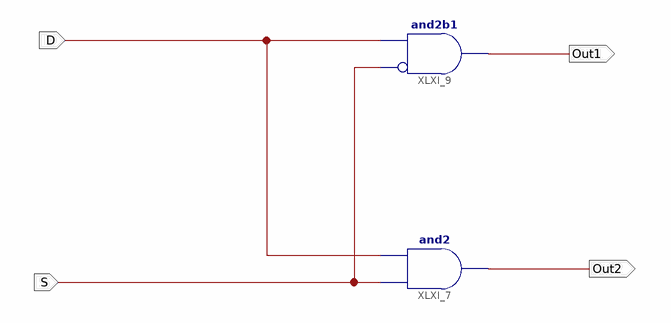
[diagram p0: schematic sheet 1]
// Xilinx ISE schematic demux2_1.sch (spartan3e) as structural Verilog: 2 symbols, 4 ports
module demux2_1 (
  input  S,
  input  D,
  output Out1,
  output Out2
);

  and XLXI_9 (Out1, ~S, D);  // and2b1
  and XLXI_7 (Out2, S, D);
endmodule
